# EAGLE design ISA Ouderen - Lamp Zender (EAGLE 6.4)
ABBREV: jn6; PROJECT: JeeNode v6

## Sheet 1 of 2
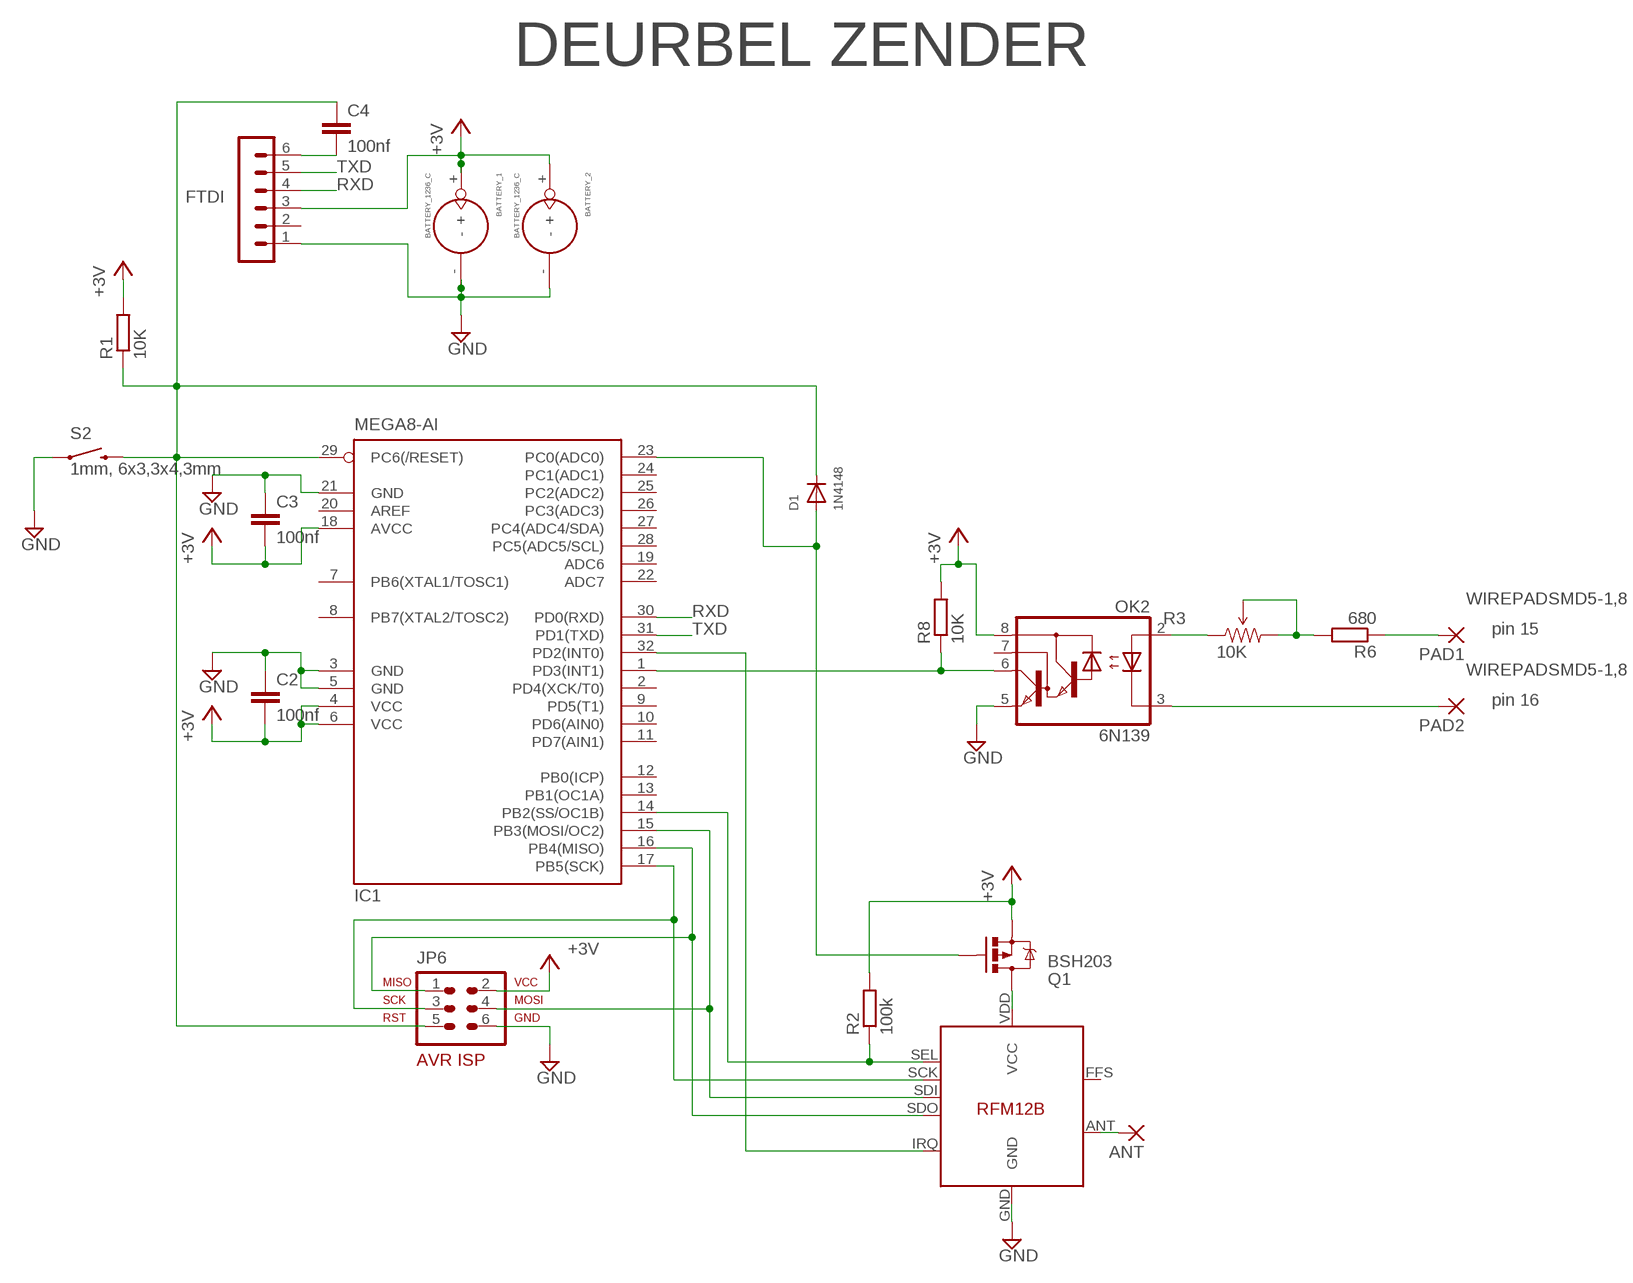
[diagram p0: schematic, sheet 1]

### Parts
ANT  1,6/0,8  [1,6/0,8]
BATTERY_1  BATTERY_1236_C  [BATTERY_1236_C]
BATTERY_2  BATTERY_1236_C  [BATTERY_1236_C]
C2  100nf  C-EUC0805  [C0805]
C3  100nf  C-EUC0805  [C0805]
C4  100nf  C-EUC0805  [C0805]
D1  1N4148  DIODESOD-323F  [SOD-323F]
FTDI  FTDI  MA06-1  [MA06-1]
IC1  MEGA8-AI  [TQFP32-08@1]
JP6  AVR-ISP-6VERT  [AVR-ISP-6]
OK2  6N139  HCPL0700  [SOIC08]
PAD1  WIREPADSMD5-1,8  [5-1,8]
PAD2  WIREPADSMD5-1,8  [5-1,8]
Q1  BSH203  MOSFET-PCHANNEL  [SOT23]
R1  10K  R-EU_R0805  [R0805]
R2  100k  R-EU_R0805  [R0805]
R3  10K  TRIMPOT  [TRIMPOT-5MM-V2]
R6  680  R-EU_R0805  [R0805]
R8  10K  R-EU_R0805  [R0805]
S2  1mm, 6x3,3x4,3mm  SWITCH-MOMENTARY-2-SMD-1101NE  [TACTILE-SWITCH-1101NE]
U$3  RFM12B  [RFM12B]

### Nets
+3V3: BATTERY_1.+ BATTERY_2.+ C2.2 C3.2 FTDI.3 IC1.4(VCC) IC1.6(VCC) IC1.18(AVCC) JP6.2 OK2.8(VCC) Q1.2(S) R1.2 R2.2 R8.2 ; supply symbol labelled +3V ; also sheet 2
GND [power]: BATTERY_1.- BATTERY_2.- C2.1 C3.1 FTDI.1 IC1.3(GND) IC1.5(GND) IC1.21(GND) JP6.6 OK2.5(GND) S2.P$1 U$3.GND ; also sheet 2
N$1: Q1.3(D) U$3.VDD(VCC)
N$2: D1.A IC1.23(PC0(ADC0)) Q1.1(G)
N$3: ANT.1(P) U$3.ANT
N$4: IC1.14(PB2(SS/OC1B)) R2.1 U$3.SEL
N$7: IC1.32(PD2(INT0)) U$3.IRQ
N$11: PAD1.1(P) R6.1
N$13: IC1.16(PB4(MISO)) JP6.1 U$3.SDO
N$18: OK2.2(A) R3.A(CCW)
N$19: IC1.17(PB5(SCK)) JP6.3 U$3.SCK
N$20: C4.2 FTDI.6
N$22: OK2.3(C) PAD2.1(P)
N$23: IC1.1(PD3(INT1)) OK2.6(VO) R8.1
N$24: R3.B(WIPER) R3.C(CW) R6.2
N$51: IC1.15(PB3(MOSI/OC2)) JP6.4 U$3.SDI
RST: C4.1 D1.C IC1.29(PC6(/RESET)) JP6.5 R1.1 S2.P$2
RXD: FTDI.4 IC1.30(PD0(RXD)) ; also sheet 2
TXD: FTDI.5 IC1.31(PD1(TXD)) ; also sheet 2
Unconnected: FTDI.2 IC1.2(PD4(XCK/T0)) IC1.7(PB6(XTAL1/TOSC1)) IC1.8(PB7(XTAL2/TOSC2)) IC1.9(PD5(T1)) IC1.10(PD6(AIN0)) IC1.11(PD7(AIN1)) IC1.12(PB0(ICP)) IC1.13(PB1(OC1A)) IC1.19(ADC6) IC1.20(AREF) IC1.22(ADC7) IC1.24(PC1(ADC1)) IC1.25(PC2(ADC2)) IC1.26(PC3(ADC3)) IC1.27(PC4(ADC4/SDA)) IC1.28(PC5(ADC5/SCL)) OK2.7(VB) U$3.FFS

### Notes on the sheet
- DEURBEL ZENDER
- pin 15
- pin 16

## Sheet 2 of 2
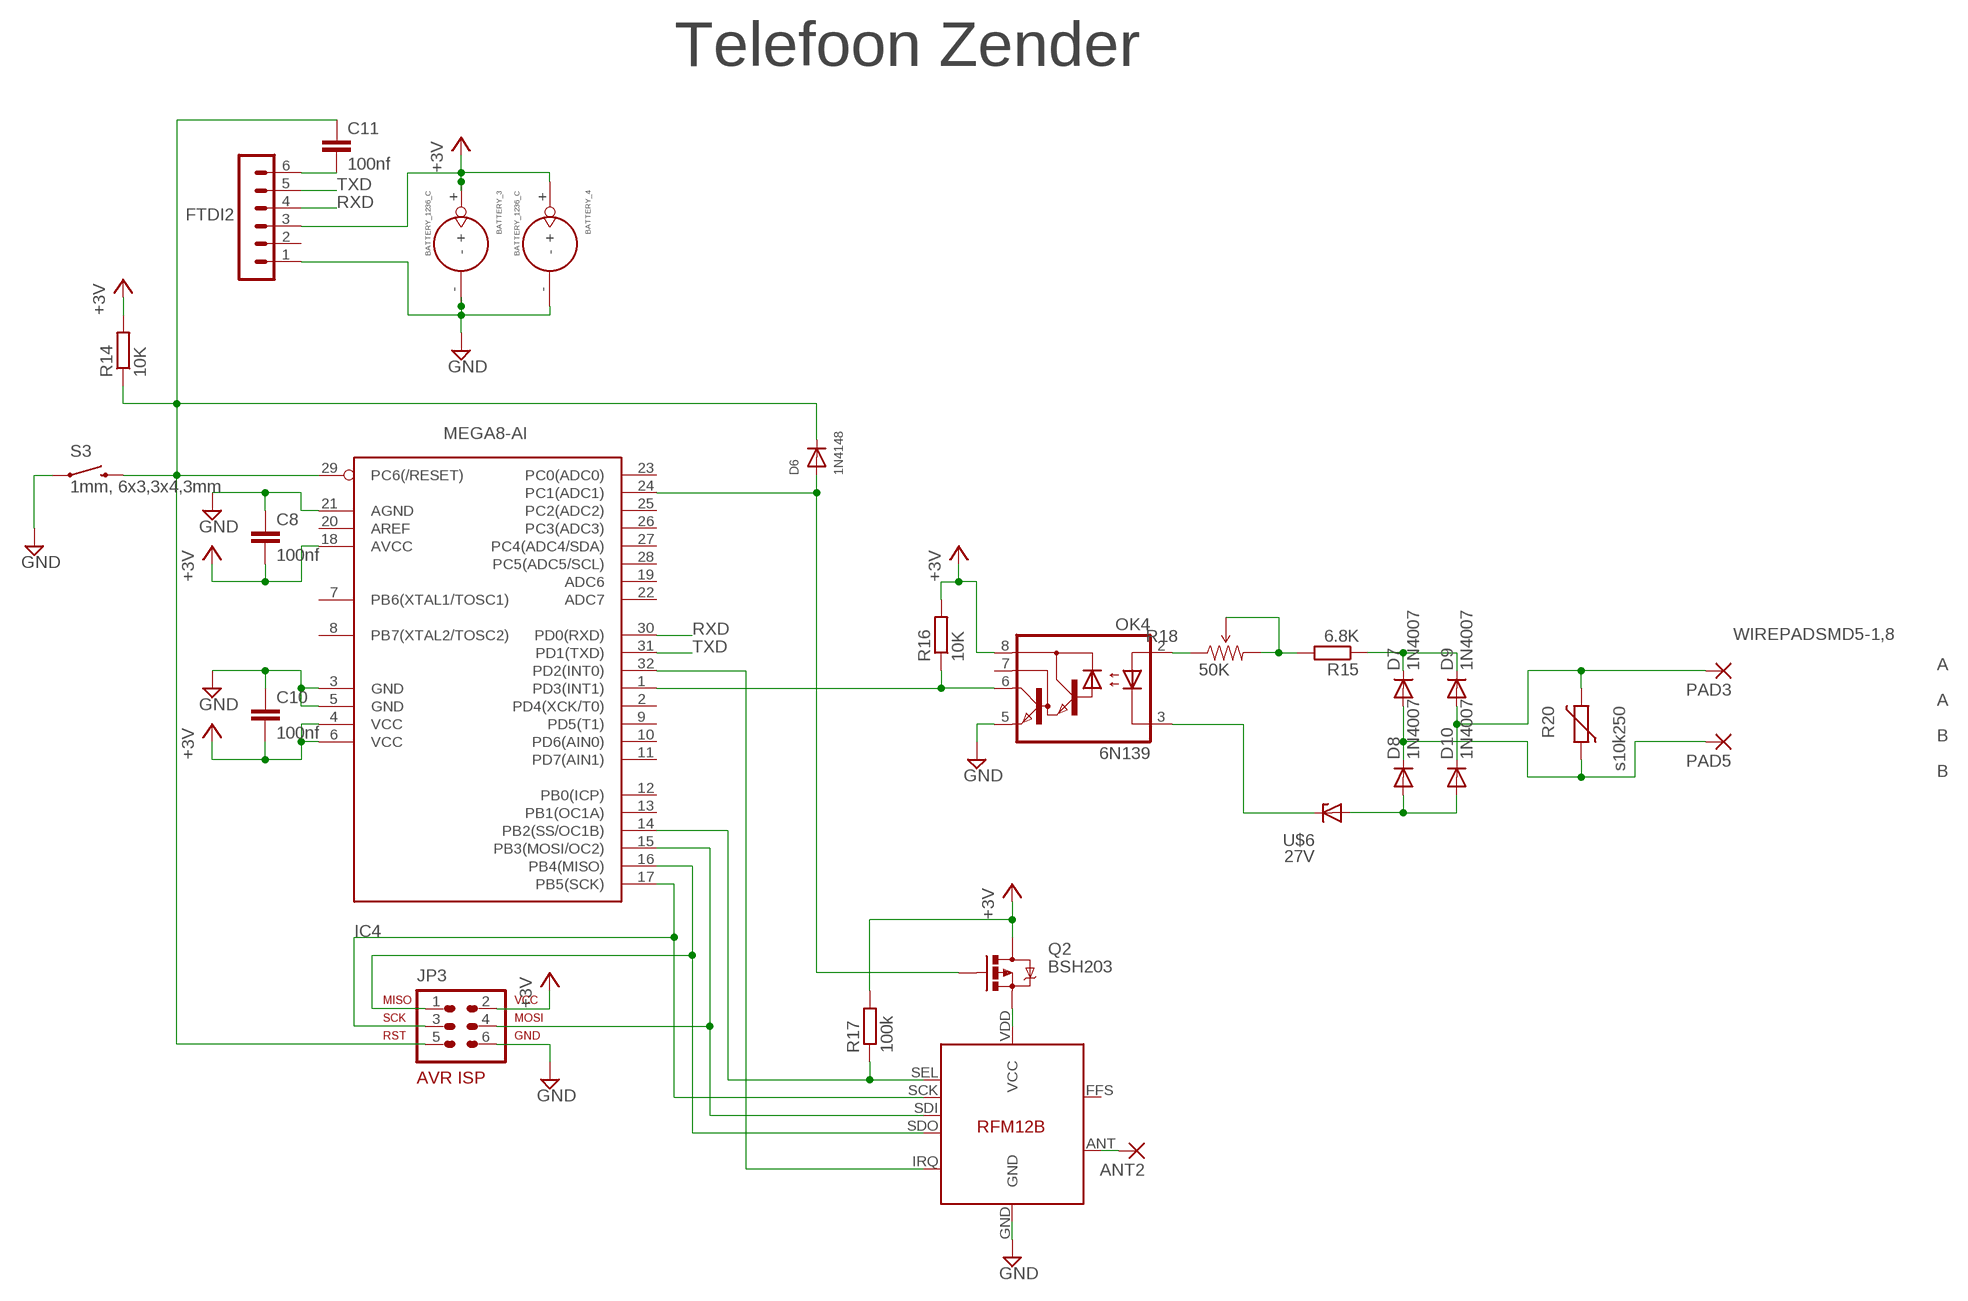
[diagram p1: schematic, sheet 2]

### Parts
ANT2  1,6/0,8  [1,6/0,8]
BATTERY_3  BATTERY_1236_C  [BATTERY_1236_C]
BATTERY_4  BATTERY_1236_C  [BATTERY_1236_C]
C8  100nf  C-EUC0805  [C0805]
C10  100nf  C-EUC0805  [C0805]
C11  100nf  C-EUC0805  [C0805]
D6  1N4148  DIODESOD-323F  [SOD-323F]
D7  1N4007  DIODE-DO214BA  [DO214BA]
D8  1N4007  DIODE-DO214BA  [DO214BA]
D9  1N4007  DIODE-DO214BA  [DO214BA]
D10  1N4007  DIODE-DO214BA  [DO214BA]
FTDI2  FTDI  MA06-1  [MA06-1]
IC4  MEGA8-AI  AVR-MEGA8-AI  [TQFP32-08]
JP3  AVR-ISP-6VERT  [AVR-ISP-6]
OK4  6N139  HCPL0700  [SOIC08]
PAD3  WIREPADSMD5-1,8  [5-1,8]
PAD5  WIREPADSMD5-1,8  [5-1,8]
Q2  BSH203  MOSFET-PCHANNEL  [SOT23]
R14  10K  R-EU_R0805  [R0805]
R15  6.8K  R-EU_R0805  [R0805]
R16  10K  R-EU_R0805  [R0805]
R17  100k  R-EU_R0805  [R0805]
R18  50K  TRIMPOT  [TRIMPOT-5MM-V2]
R20  s10k250  VARISTOR-7,5  [R-7,5]
S3  1mm, 6x3,3x4,3mm  SWITCH-MOMENTARY-2-SMD-1101NE  [TACTILE-SWITCH-1101NE]
U$5  RFM12B  [RFM12B]
U$6  27V  ZENER-DIODEZD-2.5  [ZDIO-2.5]

### Nets
+3V3: BATTERY_3.+ BATTERY_4.+ C8.2 C10.2 FTDI2.3 IC4.4(VCC) IC4.6(VCC) IC4.18(AVCC) JP3.2 OK4.8(VCC) Q2.3(D) R14.2 R16.2 R17.2 ; supply symbol labelled +3V ; also sheet 1
GND [power]: BATTERY_3.- BATTERY_4.- C8.1 C10.1 FTDI2.1 IC4.3(GND) IC4.5(GND) IC4.21(AGND) JP3.6 OK4.5(GND) S3.P$1 U$5.GND ; also sheet 1
N$36: IC4.14(PB2(SS/OC1B)) R17.1 U$5.SEL
N$37: IC4.32(PD2(INT0)) U$5.IRQ
N$38: C11.2 FTDI2.6
N$39: IC4.15(PB3(MOSI/OC2)) JP3.4 U$5.SDI
N$40: ANT2.1(P) U$5.ANT
N$41: IC4.16(PB4(MISO)) JP3.1 U$5.SDO
N$42: IC4.17(PB5(SCK)) JP3.3 U$5.SCK
N$43: OK4.2(A) R18.A(CCW)
N$44: OK4.3(C) U$6.C
N$46: IC4.1(PD3(INT1)) OK4.6(VO) R16.1
N$47: R15.2 R18.B(WIPER) R18.C(CW)
N$48: Q2.2(S) U$5.VDD(VCC)
N$50: D6.A IC4.24(PC1(ADC1)) Q2.1(G)
N$52: D9.A D10.C PAD3.1(P) R20.2
N$53: D7.A D8.C PAD5.1(P) R20.1
N$54: D8.A D10.A U$6.A
N$55: D7.C D9.C R15.1
RST2: C11.1 D6.C IC4.29(PC6(/RESET)) JP3.5 R14.1 S3.P$2
RXD: FTDI2.4 IC4.30(PD0(RXD)) ; also sheet 1
TXD: FTDI2.5 IC4.31(PD1(TXD)) ; also sheet 1
Unconnected: FTDI2.2 IC4.2(PD4(XCK/T0)) IC4.7(PB6(XTAL1/TOSC1)) IC4.8(PB7(XTAL2/TOSC2)) IC4.9(PD5(T1)) IC4.10(PD6(AIN0)) IC4.11(PD7(AIN1)) IC4.12(PB0(ICP)) IC4.13(PB1(OC1A)) IC4.19(ADC6) IC4.20(AREF) IC4.22(ADC7) IC4.23(PC0(ADC0)) IC4.25(PC2(ADC2)) IC4.26(PC3(ADC3)) IC4.27(PC4(ADC4/SDA)) IC4.28(PC5(ADC5/SCL)) OK4.7(VB) U$5.FFS

### Notes on the sheet
- Telefoon Zender
- A
- A
- B
- B

## Library data of the parts
ANT ANT2 = JeeLabs:1,6/0,8: THROUGH-HOLE PAD
BATTERY_1-BATTERY_4 = Itead_BP_110825.lbr:BATTERY_1236_C: SOC004
C2-C4 C8 C10 C11 = resistor:C-EU: CAPACITOR, European symbol
D1 D6 = adafruit:DIODE: Diode SMADIODE - SMA Surface Mount Package 20V 1A Schottky Diode Digikey: 641-1014-6-ND DO-1N4148 - Through Hole Small Current Diode SOD-123 20V 1 A (.5mV Vf) Schottky Diode - Digikey: MBRX120TPMSCT-ND SOD-323 10V 570mA (.38mV Vf, 3ns) Schottky Diode - Digikey: ZLLS410CT-ND SOD-523 30V 30mA Schottky Diode (RB751S-40TE61) - Digikey: RB751S-40TE61CT-ND SOT23-R/W - SOT23 Package (R = Solder Paste/Reflow Ovens, W = Hand-Soldering) BAT54Film 40V 300mA - Digikey: 497-7162-1-ND
D7-D10 = diode:DIODE-: DIODE
FTDI FTDI2 = JeeLabs:MA06-1: PIN HEADER
IC1 = atmel:MEGA8: MICROCONTROLLER 8 Kbytes FLASH, 1 kbytes SRAM, 512 bytes EEPROM, USART, 6-channel 10 bit ADC, 2-channel 8 bit ADC Pin compatible with Atmega48, ATMega88, ATMega168 Source: avr.lbr; MPN: ATMEGA8-16AU; OC_FARNELL: 9171371; OC_NEWARK: 73M8863
IC4 = SparkFun:AVR-MEGA8: MICROCONTROLLER 8 Kbytes FLASH 1 kbytes SRAM 512 bytes EEPROM USART 6-channel 10 bit ADC 2-channel 8 bit ADC
JP3 JP6 = avr-7:AVR-ISP-6: AVR ISP-6 Serial Programming Header
OK2 OK4 = optocoupler:HCPL0700: HEWLETT PACKARD OPTO COUPLER; MF: AGILENT TECHNOLOGIES; MPN: HCPL-0700-000E; OC_FARNELL: 9995196; OC_NEWARK: 31K6941
PAD1-PAD3 PAD5 = wirepad:WIREPAD: Wire PAD connect wire on PCB
Q1 Q2 = SparkFun:MOSFET-PCHANNEL
R1 R2 R6 R8 R14-R17 = resistor:R-EU_: RESISTOR, European symbol
R3 R18 = SparkFun-Electromechanical:TRIMPOT: Various small potentiometers for "set-and-forget" applications
R20 = varistor:VARISTOR: VARISTOR
S2 S3 = SparkFun-Electromechanical:SWITCH-MOMENTARY-2: Various NO switches- pushbuttons, reed, etc
U$3 U$5 = JeeParts:RFM12B
U$6 = diode:ZENER-DIODE: Z-Diode

## Net classes
1 power: width 0.203 mm, clearance 0.254 mm

## Board
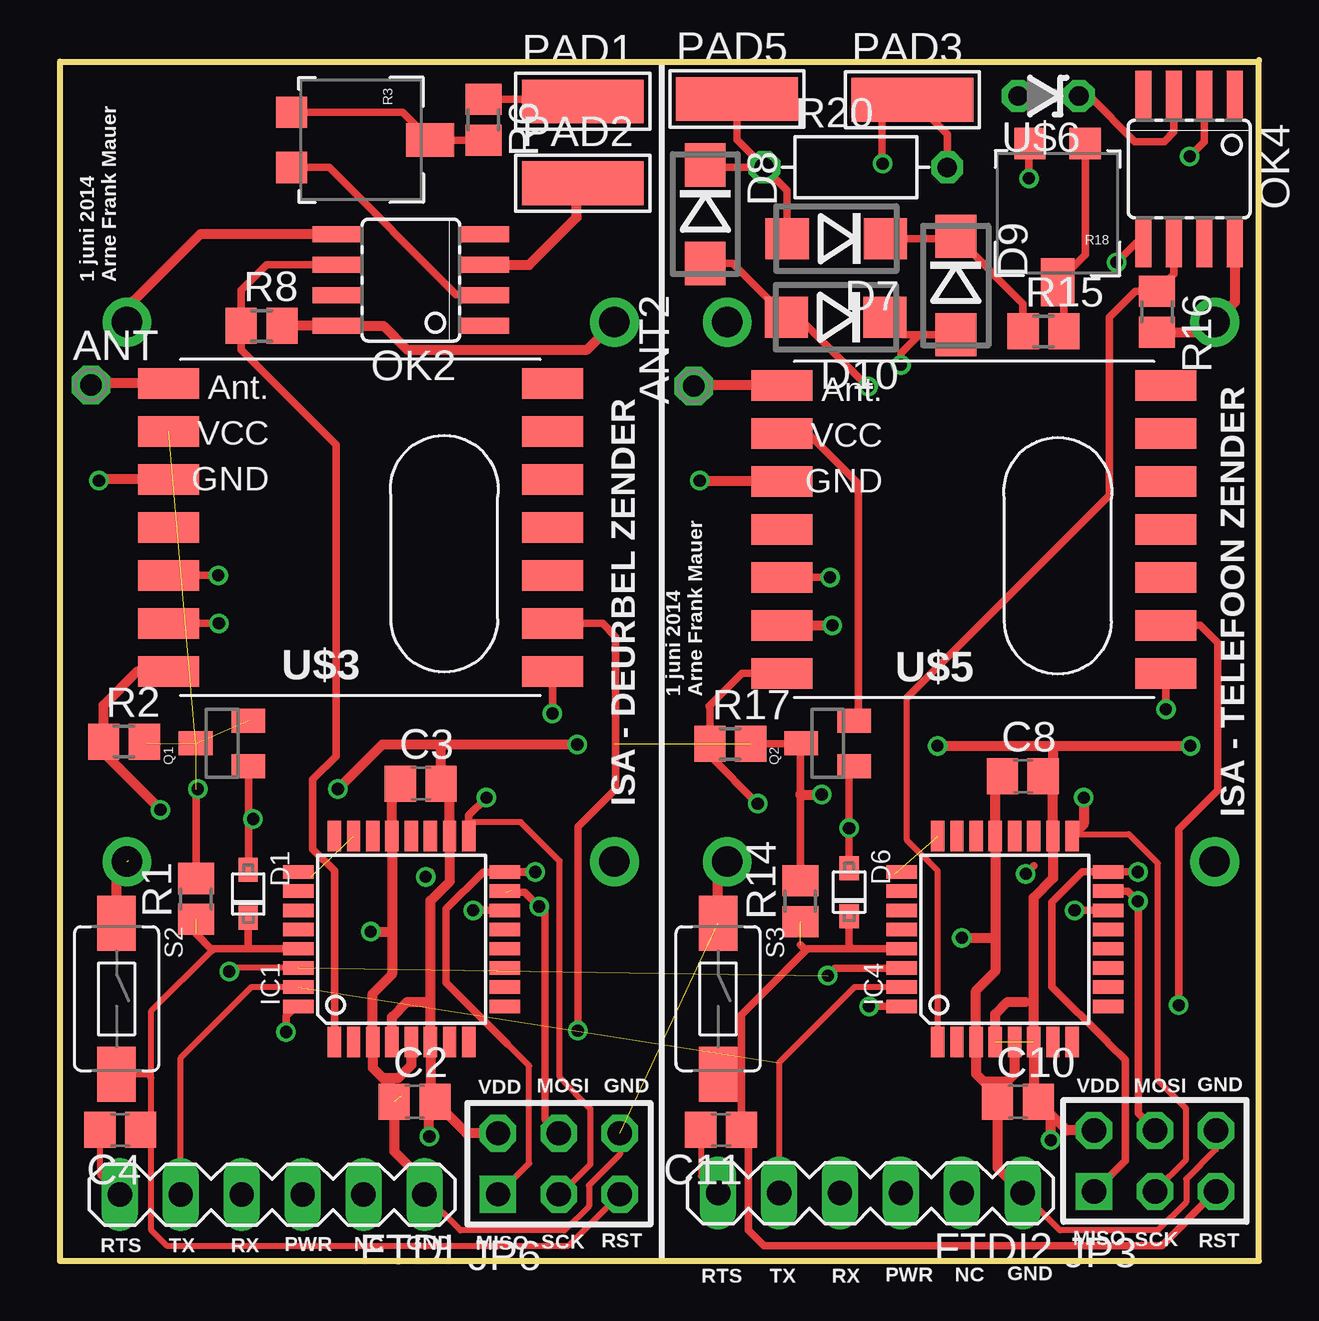
[diagram p2: board, top side]
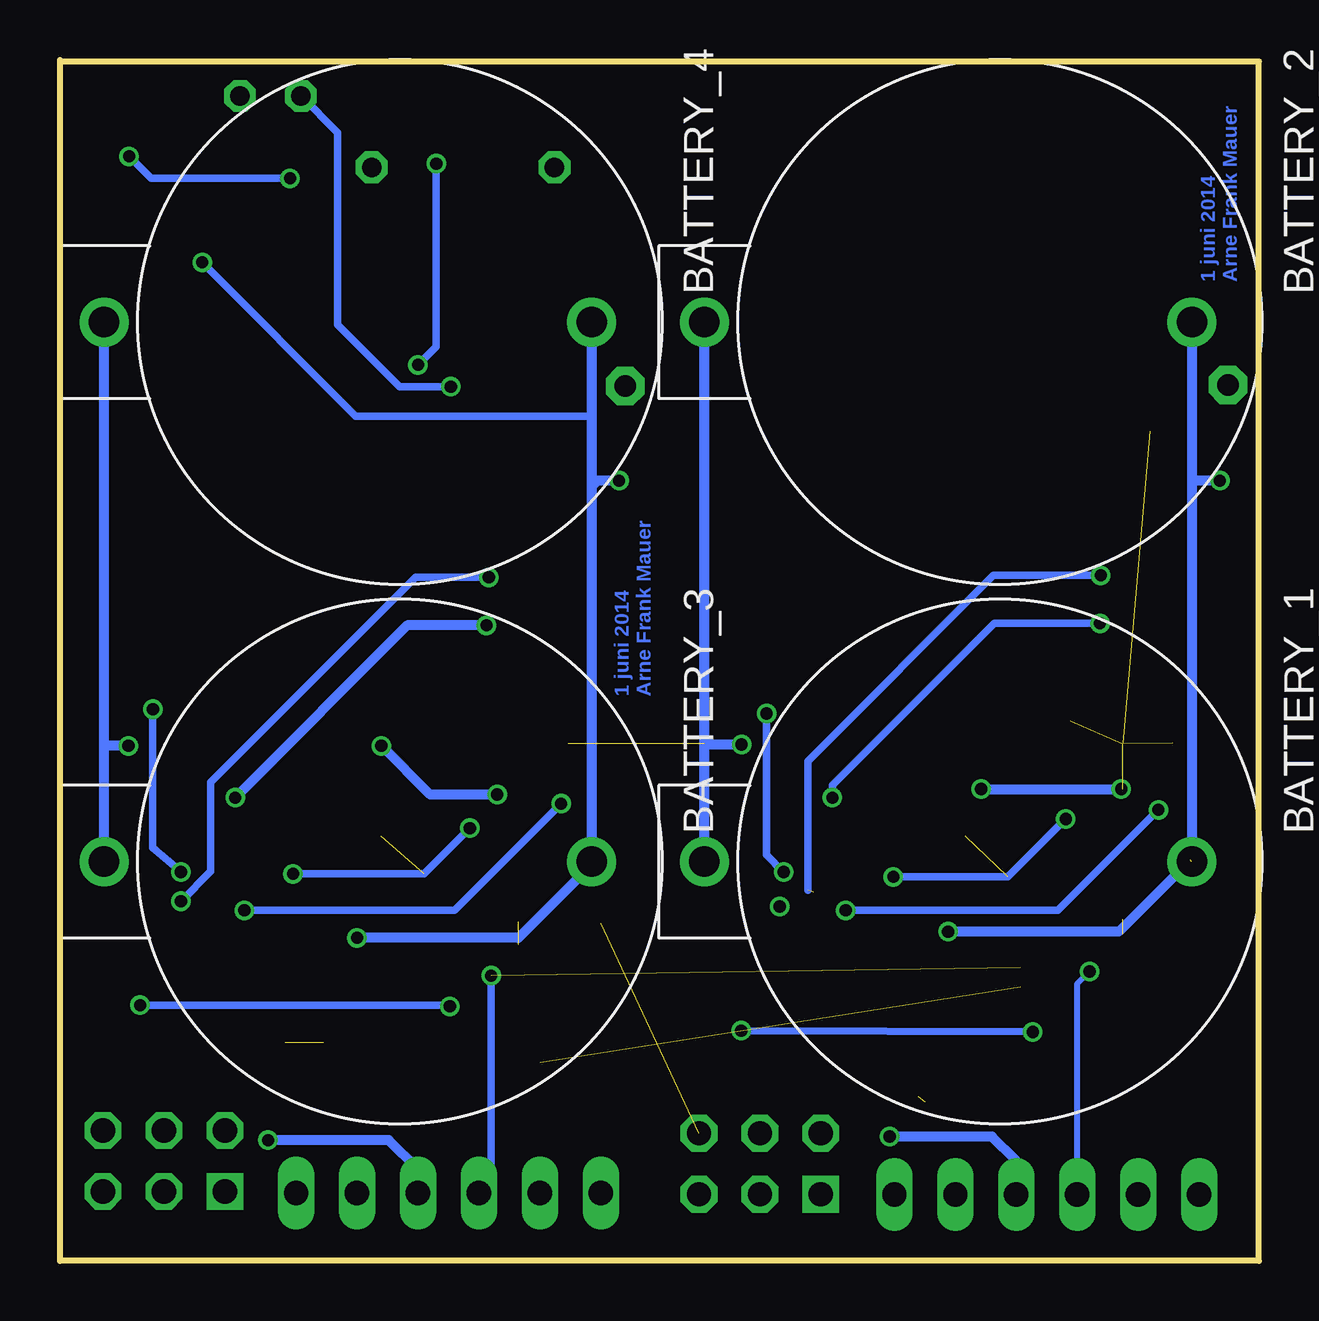
[diagram p3: board, bottom side, seen from below]

Size 49.97 x 50.04 mm. Coordinates in mm from the lower left corner, seen from the top.
Outline: 49.97,49.97 0,49.97 0,0 49.97,0 49.97,49.97
Outline: 49.97,49.97 49.97,50.04
Copper layers (1*16): Top 0.035mm / dielectric 1.5mm / Bottom 0.035mm
Design rules "ITEADstudio_DRC": minimum track width 6mil, minimum drill 12mil, track to track 6mil, track to pad 6mil, pad to pad 6mil, via to via 6mil, smd to smd 0mil, copper to edge 10mil, drill to drill 10mil, minimum pad ring 10mil, minimum via ring 6mil, stop-mask expansion 2mil, vias tented up to drill 100mil, thermal gap 10mil

### Footprints (pad centres in the part's own frame; a part is rotated, then mirrored left to right if it is on the bottom)
1,6/0,8 = drill 0.9 pad 1.6 octagon: 1 0,0
BATTERY_1236_C = drill 1.27 pad 2.032: + 0,0; - 0,20.32
C0805 = smd 1.3 x 1.5: 1 -0.85,0; 2 0.85,0
SOD-323F = smd 1 x 0.8: A -1,0; C 1,0
DO214BA = smd 1.8 x 1.7: A 2.05,0; C -2.05,0
MA06-1 = drill 1.016 long: 1 0,0; 2 2.54,0; 3 5.08,0; 4 7.62,0; 5 10.16,0; 6 12.7,0
TQFP32-08 = smd 1.27 x 0.559: 1 -4.293,2.8; 2 -4.293,2; 3 -4.293,1.2; 4 -4.293,0.4; 5 -4.293,-0.4; 6 -4.293,-1.2; 7 -4.293,-2; 8 -4.293,-2.8; 17 4.293,-2.8; 18 4.293,-2; 19 4.293,-1.2; 20 4.293,-0.4; 21 4.293,0.4; 22 4.293,1.2; 23 4.293,2; 24 4.293,2.8 | smd 0.559 x 1.27: 9 -2.8,-4.293; 10 -2,-4.293; 11 -1.2,-4.293; 12 -0.4,-4.293; 13 0.4,-4.293; 14 1.2,-4.293; 15 2,-4.293; 16 2.8,-4.293; 25 2.8,4.293; 26 2,4.293; 27 1.2,4.293; 28 0.4,4.293; 29 -0.4,4.293; 30 -1.2,4.293; 31 -2,4.293; 32 -2.8,4.293
AVR-ISP-6 = drill 1.016 square: 1 -2.54,-1.27 | drill 1.016 octagon: 2 -2.54,1.27; 3 0,-1.27; 4 0,1.27; 5 2.54,-1.27; 6 2.54,1.27
SOIC08 = smd 0.66 x 2.032: 1 -1.905,-3.073; 2 -0.635,-3.073; 3 0.635,-3.073; 4 1.905,-3.073; 5 1.905,3.073; 6 0.635,3.073; 7 -0.635,3.073; 8 -1.905,3.073
5-1,8 = smd 1.829 x 5.08: 1 0,0
SOT23 = smd 1 x 1.4: 1 -0.95,-1.1; 2 0.95,-1.1; 3 0,1.1
R0805 = smd 1.3 x 1.5: 1 -0.85,0; 2 0.85,0
TRIMPOT-5MM-V2 = smd 1.3 x 1.3: A 1.15,-2.54; C -1.15,-2.54 | smd 1.402 x 2: B 0,3.239
R-7,5 = drill 0.813 octagon: 1 -3.81,0; 2 3.81,0
TACTILE-SWITCH-1101NE = smd 2.3 x 1.6: P$1 -3.15,0; P$2 3.15,0
RFM12B = smd 2.54 x 1.27: ANT 8,-6; FFS -8,2; GND 8,-2; IRQ -8,4; P$8 -8,0; P$9 -8,-2; P$10 -8,-4; P$12 -8,-6; P$16 8,0; SCK 8,4; SDI 8,2; SDO -8,6; SEL 8,6; VDD 8,-4
ZDIO-2.5 = drill 0.813 octagon: A 1.27,0; C -1.27,0

### Placement (x,y rotation side)
ANT  1.29,36.5 0 top
ANT2  26.42,36.45 90 top
BATTERY_1  23.11,16.64 270 bottom
BATTERY_2  23.11,39.12 270 bottom
BATTERY_3  48.13,16.64 270 bottom
BATTERY_4  48.13,39.12 270 bottom
C2  14.78,6.63 0 top
C3  15.04,19.89 0 top
C4  2.51,5.46 180 top
C8  40.13,20.19 0 top
C10  39.93,6.63 0 top
C11  27.56,5.46 180 top
D1  7.85,15.29 270 top
D6  32.89,15.37 270 top
D7  32.36,42.6 180 top
D8  26.9,43.61 270 top
D9  37.34,40.64 270 top
D10  32.33,39.32 180 top
FTDI  15.19,2.77 180 top
FTDI2  40.13,2.82 180 top
IC1  MEGA8-AI  [TQFP32-08]  14.24,13.41 90 top
IC4  39.39,13.41 90 top
JP3  45.64,4.17 0 top
JP6  20.8,4.05 0 top
OK2  14.63,40.87 90 top
OK4  47.07,45.49 180 top
PAD1  21.79,48.31 270 top
PAD2  21.79,44.91 270 top
PAD3  35.53,48.39 270 top
PAD5  28.22,48.41 270 top
Q1  6.76,21.56 90 top
Q2  32,21.56 90 top
R1  5.67,15.08 90 top
R2  2.67,21.64 0 top
R3  12.19,46.71 270 top
R6  17.65,47.55 270 top
R8  8.41,38.96 0 top
R14  30.86,14.99 90 top
R15  41,38.73 0 top
R16  45.72,39.55 270 top
R17  27.94,21.54 0 top
R18  41.58,44.02 180 top
R20  33.17,45.57 0 top
S2  2.36,10.92 270 top
S3  27.43,10.92 270 top
U$3  12.53,30.57 180 top
U$5  38.1,30.48 180 top
U$6  41.2,48.54 180 top

### Tracks (layer width: path | path; a pad name or v marks a point on that pad's centre or on a via)
+3V3  (via drill 0.51)  (5 unrouted)
  Top 0.305: 3.59,21.57 R2.2 | R1.2 5.67,19.66 v5.74,19.66 | R17.2 30.88,21.54 Q2.3 30.86,21.52 30.86,19.43 R14.2
  Top 0.406: 9.16,38.96 R8.2 OK2.8 13.49,38.96 14.48,37.97 21.97,37.97 BATTERY_2.+ | v21.57,21.51 15.88,21.51 | 15.88,21.51 13.44,21.51 v11.58,19.66 | 15.88,21.51 15.89,21.5 C3.2 16.24,19.54 IC1.18 16.26,17.68 16.26,15.82 15.44,15.01 15.44,10.79 | 15.44,10.79 IC1.6 15.44,6.82 C2.2 | IC1.4 13.84,10.16 14.48,10.79 15.44,10.79 | IC4.4 38.99,10.28 39.5,10.79 40.26,10.79 | C10.2 40.59,6.44 IC4.6 40.59,15.13 41.39,15.94 IC4.18 41.39,19.79 C8.2 40.98,20.28 41.4,20.7 41.4,21.46 | 30.86,19.43 v31.75,19.43 | v36.58,21.46 41.4,21.46 | 41.4,21.46 v47.12,21.46 | 15.49,6.49 C2.2 | v15.39,5.18 15.39,6.39 C2.2 | v41.3,5.03 41.3,6.11 C10.2 | JP6.2 16.94,5.32 C2.2 | JP3.2 41.97,5.44 C10.2 | OK4.8 48.97,39.95 BATTERY_4.+ 47.72,38.7 R16.2
  Bottom 0.406: v11.58,19.66 v5.74,19.66 | BATTERY_3.+ 48.13,21.59 | 48.13,21.59 BATTERY_4.+ | BATTERY_1.+ 23.11,21.54 | 23.11,21.54 BATTERY_2.+ | v31.75,19.43 34.54,19.43 v36.58,21.46 | v47.12,21.46 48.01,21.46 48.13,21.59 | FTDI.3 10.11,4.17 11.12,5.18 v15.39,5.18 | FTDI2.3 35.05,3.81 36.27,5.03 v41.3,5.03 | v21.57,21.51 23.09,21.51 23.11,21.54
GND  (via drill 0.51)  (3 unrouted)
  Top 0.254: JP6.6 23.34,4.44 22.05,3.15 22.05,2.29 21.03,1.27 16.69,1.27 FTDI.1 | JP3.6 48.18,4.64 46.94,3.4 46.94,2.44 45.77,1.27 41.69,1.27 FTDI2.1
  Top 0.305: OK4.5 44.86,42.42 v44.04,41.6
  Top 0.406: OK2.5 5.84,42.77 2.79,39.73 BATTERY_2.- | U$3.GND 1.68,32.56 v1.63,32.51 | 13.84,13.59 IC1.21 13.84,19.54 C3.1 | 13.84,13.59 13.84,11.93 13.04,11.13 IC1.3 13.04,8.04 13.46,7.62 | 13.46,7.62 14.1,7.62 14.64,8.16 IC1.5 | 14.22,6.86 13.46,7.62 | v12.95,13.72 13.71,13.72 13.84,13.59 | FTDI.1 15.19,3.3 13.93,4.56 C2.1 | 38.99,13.59 IC4.21 38.99,19.9 C8.1 | 38.99,13.59 38.99,12.06 38.19,11.26 IC4.3 38.19,7.79 38.48,7.49 | 38.48,7.49 39.5,7.49 39.78,7.78 IC4.5 | v37.59,13.46 38.86,13.46 38.99,13.59 | U$5.GND 26.7,32.48 v26.67,32.51 | FTDI2.1 39.08,3.88 C10.1 39.08,6.89 38.48,7.49 | S2.P$1 2.36,16.2 BATTERY_1.- | S3.P$1 27.43,16.26 BATTERY_3.-
  Bottom 0.305: v44.04,41.6 37.64,35.2 27.81,35.2
  Bottom 0.406: 2.87,16.69 5.84,13.72 v12.95,13.72 | BATTERY_4.- 27.81,35.2 27.81,32.26 | 27.81,32.26 BATTERY_3.- 27.81,16.51 30.86,13.46 v37.59,13.46 | v26.67,32.51 27.56,32.51 27.81,32.26 | BATTERY_2.- 2.79,32.49 | 2.79,32.49 BATTERY_1.- | v1.63,32.51 2.77,32.51 2.79,32.49
N$1  (1 unrouted)
N$2  (via drill 0.51)  (1 unrouted)
  Top 0.305: Q1.1 7.86,18.54 | 7.86,18.54 D1.A | 7.98,18.34 7.98,18.42 7.86,18.54 | v15.24,16 15.44,16.2
  Top 0.406: 7.98,18.34 v8.05,18.41
  Bottom 0.305: v15.24,16 10.46,16 v8.05,18.41
N$3
  Top 0.406: U$3.ANT 1.35,36.56 ANT.1
N$4  (via drill 0.51)
  Top 0.305: IC1.14 v17.22,14.61
  Top 0.406: 3.98,19.01 v4.19,18.8 1.82,21.17 R2.1 1.82,23.15 3.23,24.57 U$3.SEL | IC1.14
  Bottom 0.305: v4.19,18.8 8.38,14.61 v17.22,14.61
N$7  (via drill 0.51)
  Top 0.305: IC1.32 9.85,10.61 9.42,10.19 v9.42,9.54 | U$3.IRQ 22.61,26.57 23.16,26.01 23.16,19.66 21.59,18.09 21.59,10.09 v21.58,9.59
  Bottom 0.305: v9.42,9.54 v21.58,9.59
N$11
  Top 0.305: R6.1 21.7,48.4 PAD1.1
N$13  (via drill 0.51)
  Top 0.254: JP6.1 18.27,2.78 19.56,4.06 19.56,8.13 18.63,9.06
  Top 0.305: U$3.SDO v20.52,22.81 | IC1.16 20.01,16.21 v19.81,16.2 17.62,16.2 16.1,14.68 16.1,11.58 18.63,9.06
  Bottom 0.305: v20.52,22.81 20.52,16.92 v19.81,16.2
N$18
  Top 0.305: R3.A 11.21,45.56 16.51,40.26 17.68,40.26 OK2.2
N$19  (via drill 0.51)
  Top 0.254: 17.04,18.29 19.2,18.29 20.83,16.66 20.83,7.67 22.1,6.35 22.1,4.01 20.86,2.78 JP6.3
  Top 0.305: U$3.SCK v6.63,26.57 | IC1.17 17.04,18.29 17.04,18.56 v17.78,19.3
  Bottom 0.305: v6.63,26.57 11.03,26.57 17.78,19.81 v17.78,19.3
N$20
  Top 0.254: C4.2 1.67,3.59 FTDI.6
N$22
  Top 0.406: OK2.3 19.56,41.5 21.54,43.48 21.54,44.65 PAD2.1
N$23
  Top 0.305: IC1.1 11.44,16.25 10.54,17.14 10.54,20.07 11.51,21.03 11.51,34.01 7.56,37.96 R8.1 7.56,40.45 8.61,41.5 OK2.6
N$24
  Top 0.305: R3.C 14.28,47.86 R3.B 15.44,46.7 R6.2
N$36  (via drill 0.51)
  Top 0.305: U$5.SEL 28.42,24.48 27.05,23.11 27.09,23.07 R17.1 27.09,21.04 v29.08,19.05 | IC4.14 v42.29,14.61
  Bottom 0.305: v42.29,14.61 33.53,14.61 v29.08,19.05
N$37  (via drill 0.51)
  Top 0.305: IC4.32 v33.72,10.61 | U$5.IRQ 47.54,26.48 48.26,25.76 48.26,19.61 46.63,17.98 v46.63,10.66
  Bottom 0.305: v46.63,10.66 33.77,10.66 v33.72,10.61
N$38
  Top 0.254: C11.2 26.71,3.55 FTDI2.6
N$39  (via drill 0.51)
  Top 0.305: U$5.SDI v32.1,28.48 | IC4.15 44.51,15.41 v44.93,14.99 44.96,14.96 44.96,6.15 45.64,5.46 JP3.4
  Bottom 0.305: v32.1,28.48 35.15,28.48 43.69,19.94 43.69,16.23 v44.93,14.99
N$40
  Top 0.406: U$5.ANT 26.45,36.48 ANT2.1
N$41  (via drill 0.51)
  Top 0.305: v44.93,16.21 IC4.16 42.62,16.2 41.35,14.94 41.35,11.43 43.59,9.2 43.77,9.01 44.4,8.38 44.4,4.17 43.13,2.9 JP3.1 | U$5.SDO v46.1,22.99
  Bottom 0.305: v46.1,22.99 46.1,17.22 v44.93,16.21
N$42  (via drill 0.51)
  Top 0.254: 42.27,17.78 44.55,17.78 45.77,16.56 45.77,7.52 46.94,6.35 46.94,4.22 45.64,2.92 JP3.3
  Top 0.406: U$5.SCK v32.2,26.48 | v42.67,19.3 42.67,18.19 42.27,17.78 IC4.17
  Bottom 0.406: v32.2,26.48 35.5,26.48 v42.67,19.3
N$43  (via drill 0.51)
  Top 0.305: OK4.2 47.7,46.63 v47.09,46.02 | v40.39,45.11 40.39,46.51 R18.A
  Bottom 0.305: v47.09,46.02 46.18,45.11 v40.39,45.11
N$44
  Top 0.305: U$6.C 42.9,48.54 44.81,46.63 46.02,46.63 46.43,47.04 OK4.3
N$46
  Top 0.254: IC4.1 36.59,16.25 35.31,17.53 35.31,23.47
  Top 0.305: OK4.6 46.43,41.11 R16.1 44.82,40.4 43.74,39.32 43.74,31.9 35.31,23.47
N$47
  Top 0.305: R18.C 42.73,41.93 R18.B 41.85,40.51 R15.2
N$48
  Top 0.305: U$5.VDD 31.18,34.48 33.27,32.38 33.27,22.68 Q2.2
N$50  (via drill 0.51)  (1 unrouted)
  Top 0.305: D6.A v32.89,18.03 32.89,20.4 Q2.1 | 40.59,16.46 v40.26,16.13
  Bottom 0.305: v40.26,16.13 34.8,16.13 v32.89,18.03
N$51  (via drill 0.51)  (1 unrouted)
  Top 0.254: JP6.4
  Top 0.305: IC1.15 18.57,15.37 19.37,15.37 v19.97,14.77 20.22,14.52 20.22,5.89 JP6.4 | U$3.SDI v6.59,28.57
  Bottom 0.305: 18.8,15.44 18.8,20.83 11.06,28.57 v6.59,28.57
N$52  (via drill 0.51)
  Top 0.305: D9.A 35.81,38.59 | 35.81,38.59 35.11,38.59 D10.C | v34.29,45.72 34.27,45.74 34.27,47.55 PAD3.1 36.98,46.94 R20.2 | v35.05,37.34 35.05,37.83 35.81,38.59
  Bottom 0.305: v34.29,45.72 34.29,38.1 v35.05,37.34
N$53
  Top 0.305: R20.1 26.99,45.57 D8.C | PAD5.1 28.22,46.71 R20.1 | D7.A 30.31,44.62 R20.1
N$54  (via drill 0.51)
  Top 0.305: D8.A 28.04,41.56 D10.A 30.79,39.32 v33.68,36.42
  Bottom 0.305: v33.68,36.42 35.81,36.42 38.41,39.01 38.41,47.02 U$6.A
N$55
  Top 0.305: R15.1 40.15,39.88 D9.C 37.24,42.6 D7.C
RST  (1 unrouted)
  Top 0.254: 3.81,5.08 3.81,1.27 4.45,0.64 21.2,0.64 JP6.5 | 3.81,5.08 3.81,7.62 | 3.81,7.62 3.81,10.41 6.35,12.95 6.4,13.01 | C4.1 3.43,5.46 3.81,5.08 | S2.P$2 3.66,7.77 3.81,7.62
  Top 0.305: IC1.29 7.87,13.01 | 7.87,13.01 6.4,13.01 | D1.C 7.85,13.03 7.87,13.01 | 5.67,13.63 6.35,12.95
RST2  (1 unrouted)
  Top 0.305: IC4.29 33.02,13.01 | 33.02,13.01 31.17,13.01 31.1,12.94 | 31.1,12.94 28.41,10.25 28.41,7.62 | 28.41,7.62 C11.1 28.7,5.17 28.7,1.27 29.34,0.64 45.92,0.64 JP3.5 | S3.P$2 28.26,7.77 28.41,7.62 | D6.C 32.89,13.13 33.02,13.01 | 30.86,13.18 31.1,12.94
RXD  (via drill 0.51)  (1 unrouted)
  Top 0.254: 35.08,12.19 IC4.30 | IC1.30 7.21,12.21 v7.06,12.05
  Top 0.305: 35.08,12.19 32.31,12.19 v32,11.89
  Bottom 0.254: FTDI.4 7.57,11.54 v7.06,12.05
  Bottom 0.305: v32,11.89 32,3.33 FTDI2.4
TXD  (1 unrouted)
  Top 0.254: IC4.31 33.12,11.41 29.97,8.26 FTDI2.5 | IC1.31 7.98,11.41 5.03,8.46 FTDI.5

### Text on the board
Bottom: 1 juni 2014 / Arne Frank Mauer | 1 juni 2014 / Arne Frank Mauer
tPlace: 1 juni 2014 / Arne Frank Mauer | 1 juni 2014 / Arne Frank Mauer | ISA - DEURBEL ZENDER | ISA - TELEFOON ZENDER | VDD | MOSI | GND | VDD | MOSI | GND | SCK | RST | MISO | SCK | RST | RTS | TX | RX | PWR | NC | GND | MISO | RTS | TX | RX | PWR | NC | GND